# Altium project investigator_regulator.PrjPcb
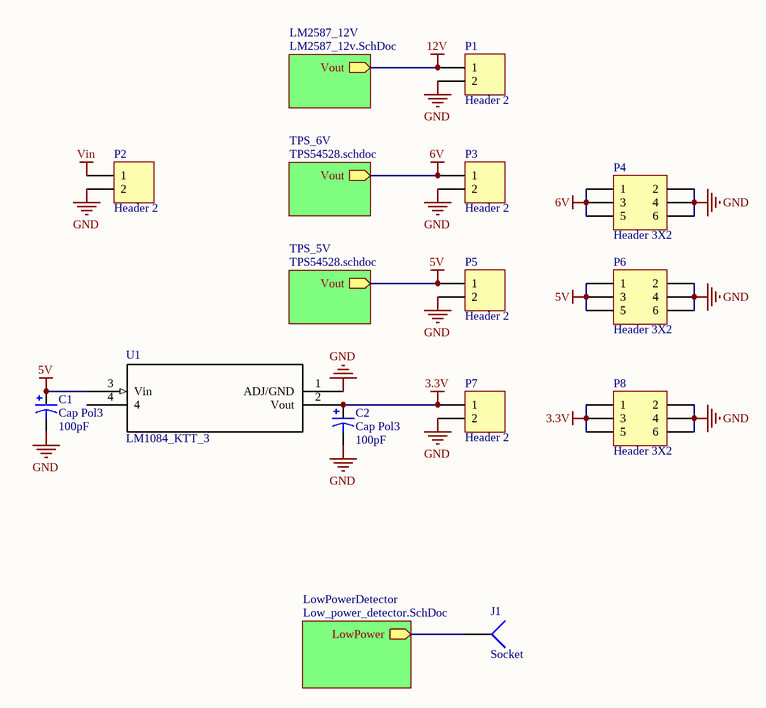
[diagram p0: investigator_regulator.SchDoc]
4 sheets, 55 parts. Net scope: hierarchical (ports join the sheet entries above them; power ports are global).
Board file: investigator_regulator.PcbDoc
Sheets:
  investigator_regulator.SchDoc
    TPS_5V = TPS54528.schdoc
    TPS_6V = TPS54528.schdoc
    LM2587_12V = LM2587_12v.SchDoc
    LowPowerDetector = Low_power_detector.SchDoc

## Sheet investigator_regulator.SchDoc
size Letter

### Parts
C1  Cap Pol3  value 100pF  [AXIAL-0.3]
C2  Cap Pol3  value 100pF  [AXIAL-0.3]
J1  Socket  [PIN1]
P1  Header 2  [WireHeader]
P2  Header 2  [WireHeader]
P3  Header 2  [WireHeader]
P4  Header 3X2  [HDR2X3]
P5  Header 2  [WireHeader]
P6  Header 3X2  [HDR2X3]
P7  Header 2  [WireHeader]
P8  Header 3X2  [HDR2X3]
U1  LM1084_KTT_3  [TS3B]

### Sub-sheets
LM2587_12V = LM2587_12v.SchDoc: Vout (out)
LowPowerDetector = Low_power_detector.SchDoc: LowPower (out)
TPS_5V = TPS54528.schdoc: Vout (out)  | Rftb_value: 121K
TPS_6V = TPS54528.schdoc: Vout (out)  | Rftb_value: 150K

### Nets
3.3V: C2.1 P7.1 P8.1 P8.3 P8.5 U1.2(Vout)
5V: C1.1 P5.1 P6.1 P6.3 P6.5 U1.3(Vin) ; sheet TPS_5V/Vout
6V: P3.1 P4.1 P4.3 P4.5 ; sheet TPS_6V/Vout
12V: P1.1 ; sheet LM2587_12V/Vout
GND: C1.2 C2.2 P1.2 P2.2 P3.2 P4.2 P4.4 P4.6 P5.2 P6.2 P6.4 P6.6 P7.2 P8.2 P8.4 P8.6 U1.1(ADJ/GND)
Vin: P2.1
LOW_POWER_BUF: J1.1 ; sheet LowPowerDetector/LowPower

Not connected (* = marked no-connect by the designer): U1 4

### Library data of the parts
C1 C2 = Cap Pol3: Polarized Capacitor (Surface Mount); Published: 8-Jun-2000; LatestRevisionDate: 29-May-2009; LatestRevisionNote: IPC-7351 Footprint Added.; PackageReference: C0805; Publisher: Altium Limited; PackageDescription: Chip Capacitor
P1-P3 P5 P7 = Header 2: Header, 2-Pin; LatestRevisionDate: 17-Jul-2002; LatestRevisionNote: Re-released for DXP Platform.; Publisher: Altium Limited
P4 P6 P8 = Header 3X2: Header, 3-Pin, Dual row; LatestRevisionDate: 17-Jul-2002; LatestRevisionNote: Re-released for DXP Platform.; Publisher: Altium Limited
U1 = LM1084_KTT_3: Imported; PartNumber: LM1084IS-33; Comp: TypeLDO; Vendor: NationalSemiconductor; base_pn: LM1084; Symbol: NameLM1084IS-33; Library: ReferenceLM1084IS; Type: DEV; Version: 1; Pin: Count3; RefDes: RefDes; Value: Value
J1 = Socket: LatestRevisionDate: 17-Jul-2002; LatestRevisionNote: Re-released for DXP Platform.; Publisher: Altium Limited

## Sheet TPS54528.schdoc
size 307 x 144 mm; SheetNumber: 1; SheetTotal: 1
Used 2 times, as channels TPS_5V, TPS_6V. Parts and nets are listed once, with the designators drawn on the sheet.
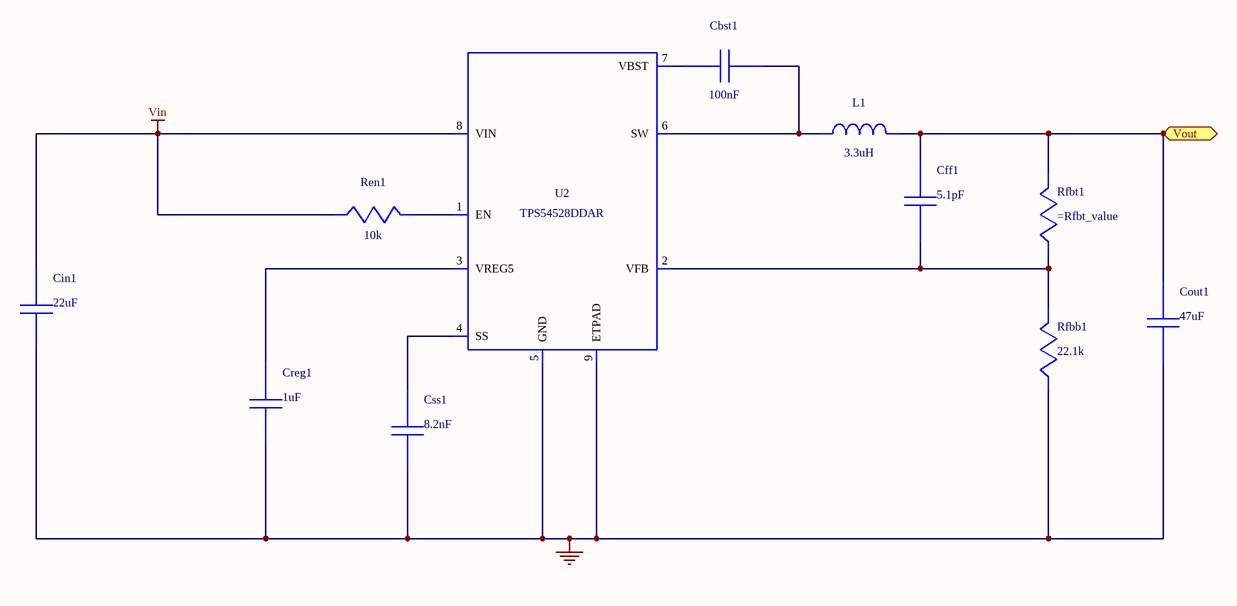
[diagram p1: TPS54528.schdoc]

### Parts
Cbst1  value 100nF  [AXIAL-0.3]  (hidden comment: C1005X5R1A104K)
Cff1  value 5.1pF  [AXIAL-0.3]  (hidden comment: GRM1555C1E5R1CA01D)
Cin1  value 22uF  [AXIAL-0.3]  (hidden comment: GRM32ER61E226KE15L)
Cout1  value 47uF  [AXIAL-0.3]  (hidden comment: GRM31CR61A476KE15L)
Creg1  value 1uF  [AXIAL-0.3]  (hidden comment: C1608X5R1A105K)
Css1  value 8.2nF  [AXIAL-0.3]  (hidden comment: GRM155R71E822KA01D)
L1  value 3.3uH  [Inductor]  (hidden comment: IHLP3232DZER3R3M11)
Ren1  value 10k  [AXIAL-0.3]  (hidden comment: CRCW040210K0FKED)
Rfbb1  value 22.1k  [AXIAL-0.3]  (hidden comment: CRCW040222K1FKED)
Rfbt1  CRCW0402121KFKED  [AXIAL-0.3]  (value not drawn)
U2  TPS54528DDAR  [DDA8_3P1X2P4]

### Ports
Vout (out)

### Nets
GND: Cin1.2 Cout1.2 Creg1.2 Css1.2 Rfbb1.2 U2.5(GND) U2.9(ETPAD)
Vin: Cin1.1 Ren1.2 U2.8(VIN)
Vout: Cff1.1 Cout1.1 L1.2 Rfbt1.1 ; port Vout
NetCbst1_1: Cbst1.1 U2.7(VBST)
NetCbst1_2: Cbst1.2 L1.1 U2.6(SW)
NetCff1_2: Cff1.2 Rfbb1.1 Rfbt1.2 U2.2(VFB)
NetCreg1_1: Creg1.1 U2.3(VREG5)
NetCss1_1: Css1.1 U2.4(SS)
NetRen1_1: Ren1.1 U2.1(EN)

### Channels
TPS_5V: designators end in _TPS_5V; ports Vout=5V
TPS_6V: designators end in _TPS_6V; ports Vout=6V

### Library data of the parts
Cbst1 = C1005X5R1A104K: Manufacturer Name: TDK; PackageReference: C1005X5R1A104K; Manufacturer Part Number: C1005X5R1A104K
Cff1 = GRM1555C1E5R1CA01D: GRM1555C1E5R1CA0; Manufacturer Name: MuRata; PackageReference: GRM1555C1E5R1CA01D; Manufacturer Part Number: GRM1555C1E5R1CA01D
Cin1 = GRM32ER61E226KE15L: GRM32ER61E226KE1; Manufacturer Name: MuRata; PackageReference: GRM32ER61E226KE15L; Manufacturer Part Number: GRM32ER61E226KE15L
Cout1 = GRM31CR61A476KE15L: GRM31CR61A476KE1; Manufacturer Name: MuRata; PackageReference: GRM31CR61A476KE15L; Manufacturer Part Number: GRM31CR61A476KE15L
Creg1 = C1608X5R1A105K: Manufacturer Name: TDK; PackageReference: C1608X5R1A105K; Manufacturer Part Number: C1608X5R1A105K
Css1 = GRM155R71E822KA01D: GRM155R71E822KA0; Manufacturer Name: MuRata; PackageReference: GRM155R71E822KA01D; Manufacturer Part Number: GRM155R71E822KA01D
L1 = IHLP3232DZER3R3M11: Unknown; Manufacturer Name: Vishay-Dale; PackageReference: IHLP3232DZER3R3M11; Manufacturer Part Number: IHLP3232DZER3R3M11
Ren1 = CRCW040210K0FKED: Manufacturer Name: Vishay-Dale; PackageReference: CRCW040210K0FKED; Manufacturer Part Number: CRCW040210K0FKED
Rfbb1 = CRCW040222K1FKED: Manufacturer Name: Vishay-Dale; PackageReference: CRCW040222K1FKED; Manufacturer Part Number: CRCW040222K1FKED
Rfbt1 = CRCW0402121KFKED: Manufacturer Name: Vishay-Dale; PackageReference: CRCW0402121KFKED; Manufacturer Part Number: CRCW0402121KFKED; Value: =Rfbt_value
U2 = TPS54528DDAR: Manufacturer Name: Texas Instruments; Value: UNLISTED; PackageReference: TPS54528DDAR; Manufacturer Part Number: TPS54528DDAR

## Sheet LM2587_12v.SchDoc
size Letter
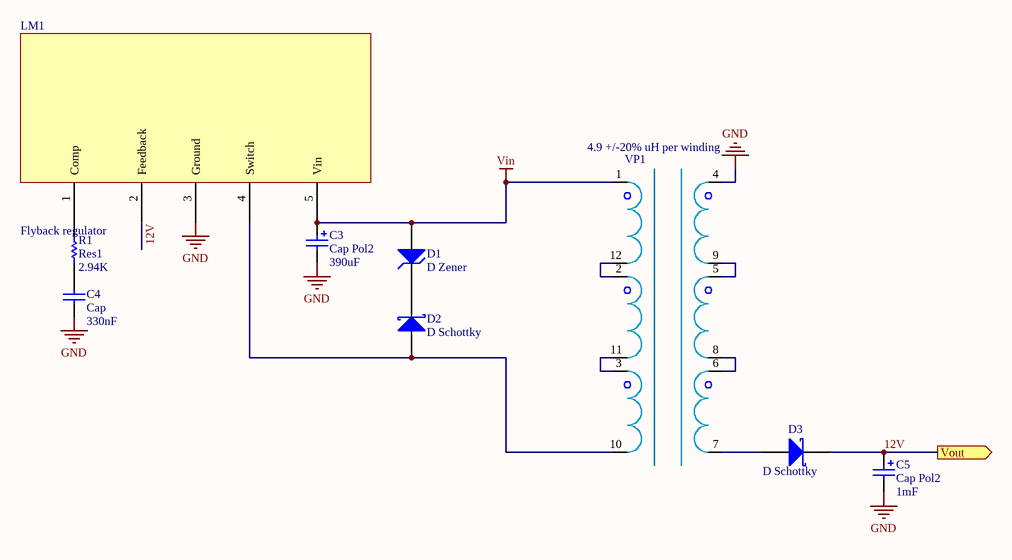
[diagram p2: LM2587_12v.SchDoc]

### Parts
C3  Cap Pol2  value 390uF  [AXIAL-0.3]
C4  Cap  value 330nF  [AXIAL-0.3]
C5  Cap Pol2  value 1mF  [AXIAL-0.3]
D1  D Zener  [DIODE]
D2  D Schottky  [DIODE]
D3  D Schottky  [DIODE]
LM1  Flyback regulator  [TS5B]
R1  Res1  value 2.94K  [AXIAL-0.3]
VP1  4.9 +/-20% uH per winding  [TRANSFORMER_SOP12]

### Ports
Vout (out)

### Nets
12V: C5.1 D3.2(K) LM1.2(Feedback) ; port Vout
GND: C3.2 C4.1 C5.2 LM1.3(Ground) VP1.4
Vin: C3.1 D1.1(A) LM1.5(Vin) VP1.1
NetC4_2: C4.2 R1.1
NetD1_2: D1.2(K) D2.2(K)
NetD2_1: D2.1(A) LM1.4(Switch) VP1.10
NetD3_1: D3.1(A) VP1.7
NetLM1_1: LM1.1(Comp) R1.2
NetVP1_2: VP1.2 VP1.12
NetVP1_3: VP1.3 VP1.11
NetVP1_5: VP1.5 VP1.9
NetVP1_6: VP1.6 VP1.8

### Library data of the parts
C3 C5 = Cap Pol2: Polarized Capacitor (Axial); Published: 8-Jun-2000; LatestRevisionDate: 17-Jul-2002; LatestRevisionNote: Re-released for DXP Platform.; PackageReference: POLAR0.8; Publisher: Altium Limited; PackageDescription: Polarized Capacitor; 2 Leads
C4 = Cap: Capacitor; Published: 8-Jun-2000; LatestRevisionDate: 17-Jul-2002; LatestRevisionNote: Re-released for DXP Platform.; PackageReference: RAD-0.3; Publisher: Altium Limited; PackageDescription: Radial Cap, Thru-Hole; 2 Leads; 0.3 in Pin Spacing
D1 = D Zener: Zener Diode; Published: 8-Jun-2000; LatestRevisionDate: 17-Jul-2002; LatestRevisionNote: Re-released for DXP Platform.; PackageReference: DIODE-0.7; Publisher: Altium Limited; PackageDescription: Diode, Thru-Hole; 2 Leads; 0.7 in Pin Spacing
D2 D3 = D Schottky: Schottky Diode; Published: 8-Jun-2000; LatestRevisionDate: 17-Jul-2002; LatestRevisionNote: Re-released for DXP Platform.; PackageReference: SMB; Publisher: Altium Limited; PackageDescription: DO-214-AA/SMB; 2 C-Bend Leads; Body 5.3 x 3.6 mm, inc. leads (LxW); Code_JEDEC: DO-214-AA
LM1 = LM2587
R1 = Res1: Resistor; Published: 8-Jun-2000; LatestRevisionDate: 17-Jul-2002; LatestRevisionNote: Re-released for DXP Platform.; PackageReference: AXIAL-0.3; Publisher: Altium Limited; PackageDescription: Axial Device, Thru-Hole; 2 Leads; 0.3 in Pin Spacing
VP1 = VP4-0060-R

## Sheet Low_power_detector.SchDoc
size Letter
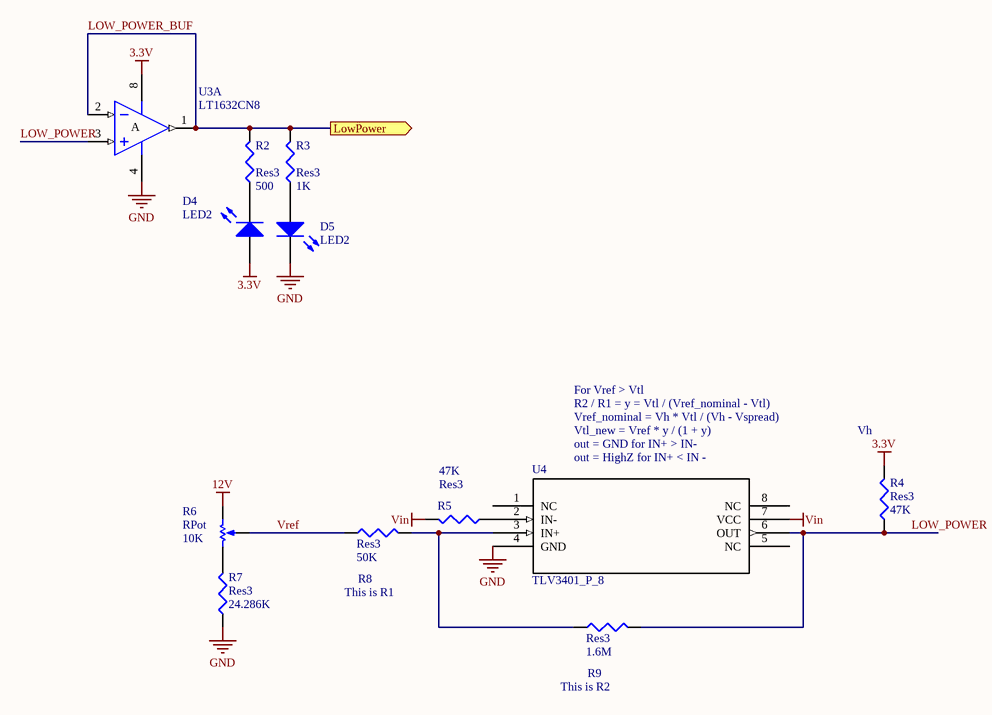
[diagram p3: Low_power_detector.SchDoc]

### Parts
D4  LED2  [3.2X1.6X1.1]
D5  LED2  [3.2X1.6X1.1]
R2  Res3  value 500  [AXIAL-0.3]
R3  Res3  value 1K  [AXIAL-0.3]
R4  Res3  value 47K  [AXIAL-0.3]
R5  Res3  value 47K  [AXIAL-0.3]
R6  RPot  value 10K  [RPot]
R7  Res3  value 24.286K  [AXIAL-0.3]
R8  Res3  value 50K  [AXIAL-0.3]
R9  Res3  value 1.6M  [AXIAL-0.3]
U3  LT1632CN8  [P8]  (part A of 2)
U4  TLV3401_P_8  [P8]

### Ports
LowPower (out)

### Nets
3.3V: D4.1(A) R4.2 U3.8(V+)
12V: R6.1(TOP)
GND: D5.2(K) R7.1 U3.4(V-) U4.4(GND)
Vin: R5.2 U4.7(VCC)
LOW_POWER: R4.1 R9.2 U3.3(IN+) U4.6(OUT)
LOW_POWER_BUF: R2.2 R3.2 U3.1(OUT) U3.2(IN-) ; port LowPower
Vref: R6.3(TAP) R8.1
NetD4_2: D4.2(K) R2.1
NetD5_1: D5.1(A) R3.1
NetR5_1: R5.1 U4.2(IN-)
NetR6_2: R6.2(BOT) R7.2
NetR8_2: R8.2 R9.1 U4.3(IN+)

Not connected (* = marked no-connect by the designer): U4 1(NC) 5(NC) 8(NC)

### Notes on the sheet
- R2 / R1 = y = Vtl / (Vref_nominal - Vtl)
- For Vref > Vtl
- out = GND for IN+ > IN-
- (near U4) out = HighZ for IN+ < IN -
- Vtl_new = Vref * y / (1 + y)
- Vref_nominal = Vh * Vtl / (Vh - Vspread)
- (near R4) Vh
- This is R1
- This is R2
- (in symbol LT1632CN8, part A) A

### Library data of the parts
D4 D5 = LED2: Typical RED, GREEN, YELLOW, AMBER GaAs LED; Published: 8-Jun-2000; LatestRevisionDate: 17-Jul-2002; LatestRevisionNote: Re-released for DXP Platform.; PackageVersion: Feb-2002; PackageReference: 3.2X1.6X1.1; Publisher: Altium Limited; PackageDescription: SM LED; 2 Flat Leads
R2-R5 R7-R9 = Res3: Resistor; Published: 8-Jun-2000; LatestRevisionDate: 29-May-2009; LatestRevisionNote: IPC-7351 Footprint Added.; PackageReference: J1-0603; Publisher: Altium Limited; PackageDescription: Chip Resistor
R6 = RPot: Potentiometer; Sim Note: Enter the Resistance value and the set point into parameter fields.; Set Position: 0.5; Published: 8-Jun-2000; LatestRevisionDate: 17-Jul-2002; LatestRevisionNote: Re-released for DXP Platform.; PackageReference: VR5; Publisher: Altium Limited; PackageDescription: Variable Resistor, Thru-Hole; 3 Leads
U3 = LT1632CN8: 45MHz, 45V/µs, Dual Rail-to-Rail Input and Output Precision Operational Amplifier; Note: 1455; Published: 8-Jun-2000; LatestRevisionDate: 29-May-2009; LatestRevisionNote: Component Body Added.; DatasheetVersion: 1996; PackageVersion: N8 1002; PackageReference: N8; Publisher: Altium Limited; PackageDescription: DIP, Plastic, 8-Pin, Row Spacing 7.62 mm, Pitch 2.54 mm; ComponentLink1Description: Manufacturer Link; ComponentLink1URL: http://www.linear.com/; ComponentLink2Description: Datasheet; ComponentLink2URL: http://www.linear.com/pc/downloadDocument.do?navId=H0,C1,C1154,C1009,C1022,P1642,D3055
U4 = TLV3401_P_8: Imported; Vendor: Texas Instruments; PACKAGE_DESIGNATOR: P; PIN_COUNT: 8; FAMILY_NAME: COMPARATOR; INDUSTRY_STD_PKG_TYPE: PDIP; Manufacturer_Part_Number: tlv3401_p_8; GENERIC_PART_NUMBER: TLV3401; Datasheet URL: http://www.ti.com/lit/gpn/TLV3401; Manufacturer: Texas Instruments; RefDes: RefDes; Type: DEV; Value: Value

## Nets that join several sheets
3.3V: investigator_regulator (6 pins), Low_power_detector (D4.1 R4.2 U3.8)
5V: investigator_regulator (6 pins), TPS_5V (Cff1_TPS_5V.1 Cout1_TPS_5V.1 L1_TPS_5V.2 Rfbt1_TPS_5V.1)
6V: investigator_regulator (P3.1 P4.1 P4.3 P4.5), TPS_6V (Cff1_TPS_6V.1 Cout1_TPS_6V.1 L1_TPS_6V.2 Rfbt1_TPS_6V.1)
12V: investigator_regulator (P1.1), LM2587_12v (C5.1 D3.2 LM1.2), Low_power_detector (R6.1)
GND: investigator_regulator (17 pins), TPS_5V (7 pins), TPS_6V (7 pins), LM2587_12v (5 pins), Low_power_detector (D5.2 R7.1 U3.4 U4.4)
Vin: investigator_regulator (P2.1), TPS_5V (Cin1_TPS_5V.1 Ren1_TPS_5V.2 U2_TPS_5V.8), TPS_6V (Cin1_TPS_6V.1 Ren1_TPS_6V.2 U2_TPS_6V.8), LM2587_12v (C3.1 D1.1 LM1.5 VP1.1), Low_power_detector (R5.2 U4.7)
LOW_POWER_BUF: investigator_regulator (J1.1), Low_power_detector (R2.2 R3.2 U3.1 U3.2)